# Altium project bai 2.PrjPCB
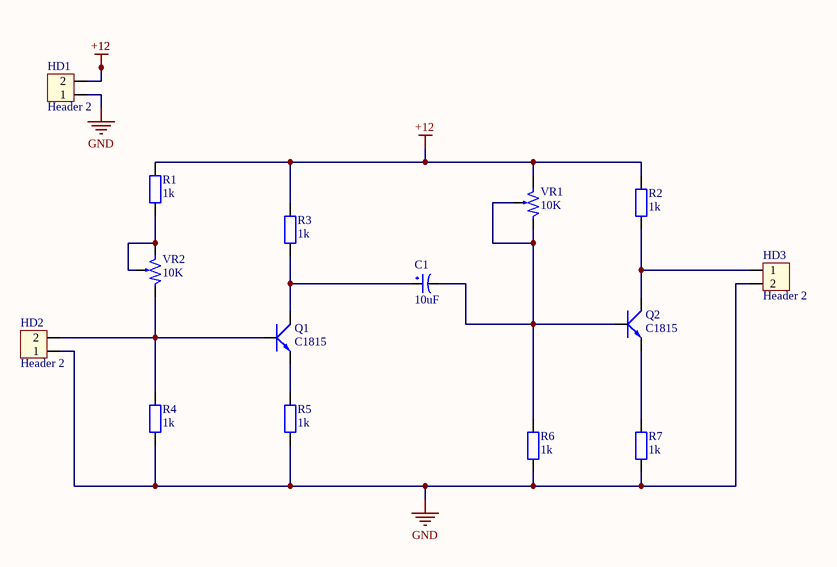
[diagram p0: bai 2.SchDoc]
1 sheet, 15 parts. Net scope: global (net labels, ports and power ports of the same name join across sheets).
Board file: bai 2.PcbDoc

## Sheet bai 2.SchDoc
size A

### Parts
C1  10uF  [CP1/2]
HD1  Header 2  [HED2]
HD2  Header 2  [HED2]
HD3  Header 2  [HED2]
Q1  C1815  [QTO-92]
Q2  C1815  [QTO-92]
R1  1k  [R1/4W]
R2  1k  [R1/4W]
R3  1k  [R1/4W]
R4  1k  [R1/4W]
R5  1k  [R1/4W]
R6  1k  [R1/4W]
R7  1k  [R1/4W]
VR1  10K  [VR]
VR2  10K  [VR]

### Nets
+12: HD1.2 R1.2 R2.2 R3.2 VR1.3
GND: HD1.1 HD2.1 HD3.2 R4.1 R5.2 R6.1 R7.1
NetC1_1: C1.1 Q1.2(C) R3.1
NetC1_2: C1.2 Q2.3(B) R6.2 VR1.1 VR1.2
NetHD2_2: HD2.2 Q1.3(B) R4.2 VR2.1
NetHD3_1: HD3.1 Q2.2(C) R2.1
NetQ1_1: Q1.1(E) R5.1
NetQ2_1: Q2.1(E) R7.2
NetR1_1: R1.1 VR2.2 VR2.3

### Library data of the parts
C1 = CP1: Cap P  0,1uF < 22uF , 16 - 50V; Value: 10uF/50V; Description 1: 10 => 220uF/6,3V/10V - 10uF => 100uF/16V; Description 2: 0,1uF => 33uF/50V - 10uF => 22uF/63V; Description 3: 0,47uF => 10uF/100V
HD1-HD3 = Hed2: Header 2 (Green); Value: Header 2
Q1 Q2 = C1815: NPN 600mW, ECB; Value: C1815
R1-R7 = R1/4W: Resistor 1/4W; Value: R1/4W - 1K
VR1 VR2 = VR1: Var Resistor; Value: VR 10K